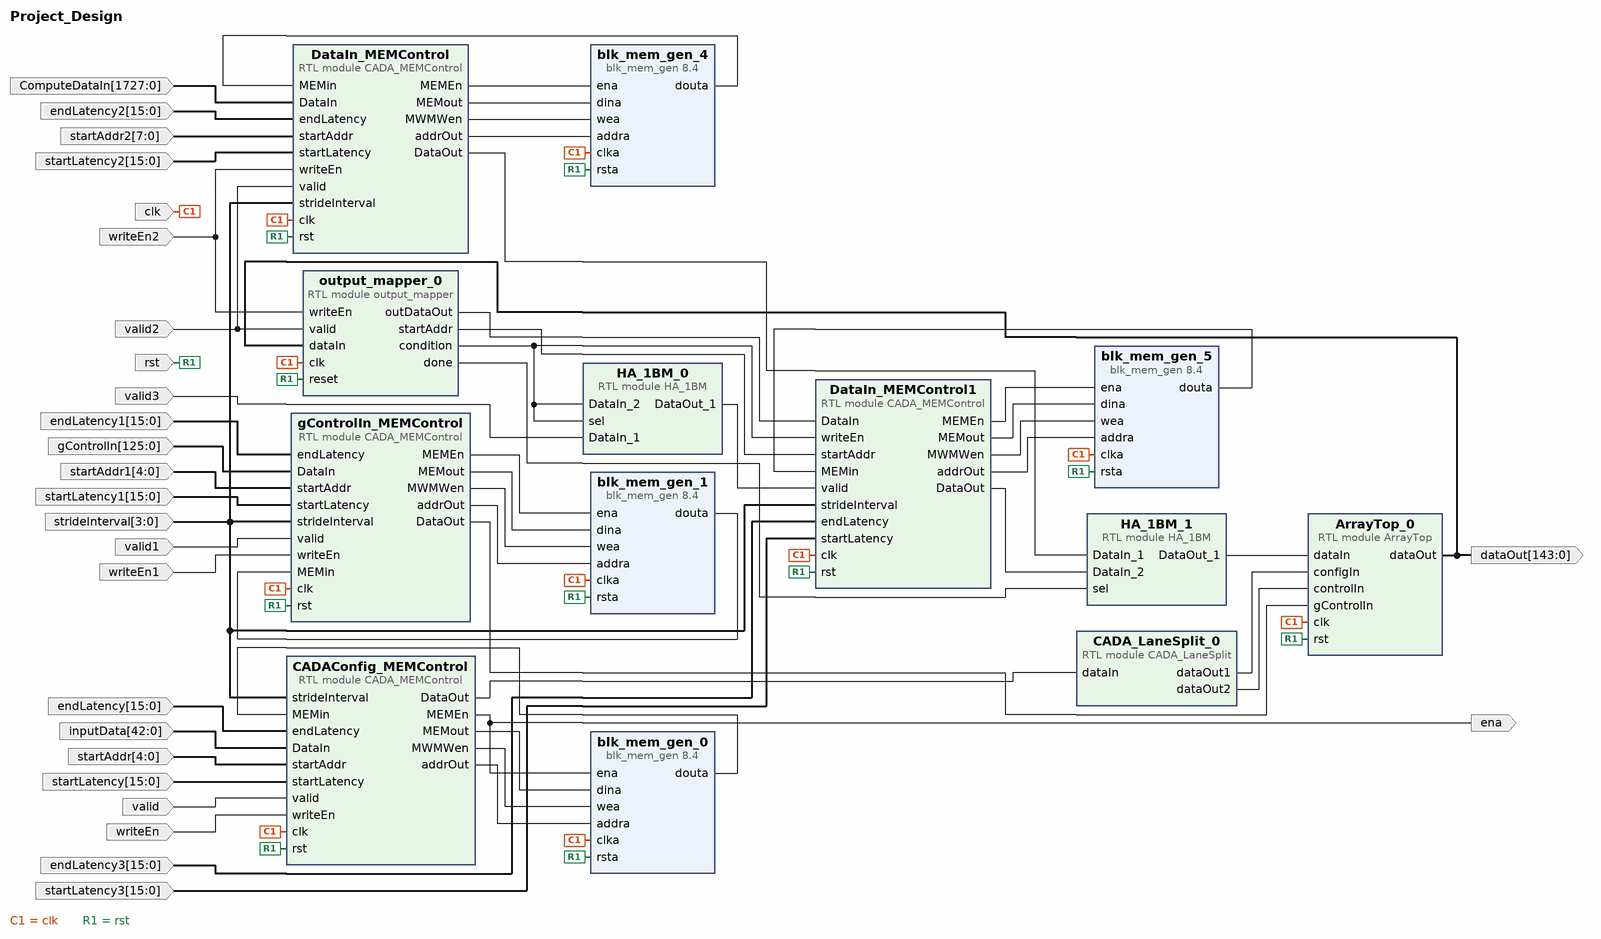
[diagram p0: block diagram of the top level]
# Vivado block design Project_Design, xc7z020clg400-2, Vivado 2023.2
create_bd_design Project_Design

create_bd_port -dir I -from 1727 -to 0 ComputeDataIn
create_bd_port -dir I clk
create_bd_port -dir O -from 143 -to 0 dataOut
create_bd_port -dir O ena
create_bd_port -dir I -from 15 -to 0 endLatency
create_bd_port -dir I -from 125 -to 0 gControlIn
create_bd_port -dir I -from 42 -to 0 inputData
create_bd_port -dir I rst
create_bd_port -dir I -from 4 -to 0 startAddr
create_bd_port -dir I -from 15 -to 0 startLatency
create_bd_port -dir I -from 3 -to 0 strideInterval
create_bd_port -dir I valid
create_bd_port -dir I writeEn
create_bd_port -dir I -from 15 -to 0 endLatency1
create_bd_port -dir I -from 4 -to 0 startAddr1
create_bd_port -dir I -from 15 -to 0 startLatency1
create_bd_port -dir I valid1
create_bd_port -dir I writeEn1
create_bd_port -dir I -from 15 -to 0 endLatency2
create_bd_port -dir I -from 15 -to 0 startLatency2
create_bd_port -dir I valid2
create_bd_port -dir I writeEn2
create_bd_port -dir I -from 7 -to 0 startAddr2
create_bd_port -dir I -from 15 -to 0 endLatency3
create_bd_port -dir I -from 15 -to 0 startLatency3
create_bd_port -dir I valid3

create_bd_cell -type module -reference ArrayTop ArrayTop_0
create_bd_cell -type module -reference CADA_LaneSplit CADA_LaneSplit_0
create_bd_cell -type module -reference CADA_MEMControl CADAConfig_MEMControl
create_bd_cell -type ip -vlnv xilinx.com:ip:blk_mem_gen:8.4 blk_mem_gen_0
set_property -dict [list \
  CONFIG.Memory_Type Single_Port_RAM \
  CONFIG.Use_RSTA_Pin true \
  CONFIG.Write_Depth_A 32 \
  CONFIG.Write_Width_A 43 \
  CONFIG.use_bram_block Stand_Alone \
] [get_bd_cells blk_mem_gen_0]
create_bd_cell -type module -reference CADA_MEMControl DataIn_MEMControl
set_property -dict {CONFIG.Data_bitWidth 1728 CONFIG.addr_BW 8} [get_bd_cells DataIn_MEMControl]
create_bd_cell -type module -reference CADA_MEMControl gControlIn_MEMControl
set_property -dict {CONFIG.Data_bitWidth 126 CONFIG.addr_BW 5} [get_bd_cells gControlIn_MEMControl]
create_bd_cell -type ip -vlnv xilinx.com:ip:blk_mem_gen:8.4 blk_mem_gen_1
set_property -dict [list \
  CONFIG.Memory_Type Single_Port_RAM \
  CONFIG.Use_RSTA_Pin true \
  CONFIG.Write_Depth_A 32 \
  CONFIG.Write_Width_A 126 \
  CONFIG.use_bram_block Stand_Alone \
] [get_bd_cells blk_mem_gen_1]
create_bd_cell -type ip -vlnv xilinx.com:ip:blk_mem_gen:8.4 blk_mem_gen_4
set_property -dict [list \
  CONFIG.Memory_Type Single_Port_RAM \
  CONFIG.Use_RSTA_Pin true \
  CONFIG.Write_Depth_A 256 \
  CONFIG.Write_Width_A 1728 \
  CONFIG.use_bram_block Stand_Alone \
] [get_bd_cells blk_mem_gen_4]
create_bd_cell -type module -reference output_mapper output_mapper_0
create_bd_cell -type module -reference CADA_MEMControl DataIn_MEMControl1
set_property -dict {CONFIG.Data_bitWidth 1728 CONFIG.addr_BW 8} [get_bd_cells DataIn_MEMControl1]
create_bd_cell -type ip -vlnv xilinx.com:ip:blk_mem_gen:8.4 blk_mem_gen_5
set_property -dict [list \
  CONFIG.Memory_Type Single_Port_RAM \
  CONFIG.Use_RSTA_Pin true \
  CONFIG.Write_Depth_A 256 \
  CONFIG.Write_Width_A 1728 \
  CONFIG.use_bram_block Stand_Alone \
] [get_bd_cells blk_mem_gen_5]
create_bd_cell -type module -reference HA_1BM HA_1BM_0
set_property -dict {CONFIG.Mux_BW 1} [get_bd_cells HA_1BM_0]
create_bd_cell -type module -reference HA_1BM HA_1BM_1
set_property -dict {CONFIG.Mux_BW 1728} [get_bd_cells HA_1BM_1]

# ---- connections ----

connect_bd_net [get_bd_pins ArrayTop_0/dataOut] [get_bd_ports dataOut] [get_bd_pins output_mapper_0/dataIn]
connect_bd_net [get_bd_pins CADA_LaneSplit_0/dataOut1] [get_bd_pins ArrayTop_0/configIn]
connect_bd_net [get_bd_pins CADA_LaneSplit_0/dataOut2] [get_bd_pins ArrayTop_0/controlIn]
connect_bd_net -net CADA_MEMControl_0_DataOut [get_bd_pins CADAConfig_MEMControl/DataOut] [get_bd_pins CADA_LaneSplit_0/dataIn]
connect_bd_net -net CADA_MEMControl_0_MEMEn [get_bd_pins CADAConfig_MEMControl/MEMEn] [get_bd_pins blk_mem_gen_0/ena] [get_bd_ports ena]
connect_bd_net -net CADA_MEMControl_0_MEMout [get_bd_pins CADAConfig_MEMControl/MEMout] [get_bd_pins blk_mem_gen_0/dina]
connect_bd_net -net CADA_MEMControl_0_MWMWen [get_bd_pins CADAConfig_MEMControl/MWMWen] [get_bd_pins blk_mem_gen_0/wea]
connect_bd_net -net CADA_MEMControl_0_addrOut [get_bd_pins CADAConfig_MEMControl/addrOut] [get_bd_pins blk_mem_gen_0/addra]
connect_bd_net -net CADA_MEMControl_2_DataOut [get_bd_pins gControlIn_MEMControl/DataOut] [get_bd_pins ArrayTop_0/gControlIn]
connect_bd_net -net CADA_MEMControl_2_MEMEn [get_bd_pins gControlIn_MEMControl/MEMEn] [get_bd_pins blk_mem_gen_1/ena]
connect_bd_net -net CADA_MEMControl_2_MEMout [get_bd_pins gControlIn_MEMControl/MEMout] [get_bd_pins blk_mem_gen_1/dina]
connect_bd_net -net CADA_MEMControl_2_MWMWen [get_bd_pins gControlIn_MEMControl/MWMWen] [get_bd_pins blk_mem_gen_1/wea]
connect_bd_net -net CADA_MEMControl_2_addrOut [get_bd_pins gControlIn_MEMControl/addrOut] [get_bd_pins blk_mem_gen_1/addra]
connect_bd_net [get_bd_ports ComputeDataIn] [get_bd_pins DataIn_MEMControl/DataIn]
connect_bd_net [get_bd_pins DataIn_MEMControl1/DataOut] [get_bd_pins HA_1BM_1/DataIn_2]
connect_bd_net [get_bd_pins DataIn_MEMControl1/MEMEn] [get_bd_pins blk_mem_gen_5/ena]
connect_bd_net [get_bd_pins DataIn_MEMControl1/MEMout] [get_bd_pins blk_mem_gen_5/dina]
connect_bd_net [get_bd_pins DataIn_MEMControl1/MWMWen] [get_bd_pins blk_mem_gen_5/wea]
connect_bd_net [get_bd_pins DataIn_MEMControl1/addrOut] [get_bd_pins blk_mem_gen_5/addra]
connect_bd_net [get_bd_pins DataIn_MEMControl/DataOut] [get_bd_pins HA_1BM_1/DataIn_1]
connect_bd_net [get_bd_pins DataIn_MEMControl/MEMEn] [get_bd_pins blk_mem_gen_4/ena]
connect_bd_net [get_bd_pins DataIn_MEMControl/MEMout] [get_bd_pins blk_mem_gen_4/dina]
connect_bd_net [get_bd_pins DataIn_MEMControl/MWMWen] [get_bd_pins blk_mem_gen_4/wea]
connect_bd_net [get_bd_pins DataIn_MEMControl/addrOut] [get_bd_pins blk_mem_gen_4/addra]
connect_bd_net [get_bd_pins HA_1BM_0/DataOut_1] [get_bd_pins DataIn_MEMControl1/valid]
connect_bd_net [get_bd_pins HA_1BM_1/DataOut_1] [get_bd_pins ArrayTop_0/dataIn]
connect_bd_net [get_bd_ports writeEn2] [get_bd_pins DataIn_MEMControl/writeEn] [get_bd_pins output_mapper_0/writeEn]
connect_bd_net [get_bd_pins blk_mem_gen_0/douta] [get_bd_pins CADAConfig_MEMControl/MEMin]
connect_bd_net [get_bd_pins blk_mem_gen_1/douta] [get_bd_pins gControlIn_MEMControl/MEMin]
connect_bd_net [get_bd_pins blk_mem_gen_4/douta] [get_bd_pins DataIn_MEMControl/MEMin]
connect_bd_net [get_bd_pins blk_mem_gen_5/douta] [get_bd_pins DataIn_MEMControl1/MEMin]
connect_bd_net [get_bd_ports clk] \
  [get_bd_pins CADAConfig_MEMControl/clk] [get_bd_pins blk_mem_gen_0/clka] [get_bd_pins blk_mem_gen_1/clka] \
  [get_bd_pins blk_mem_gen_4/clka] [get_bd_pins ArrayTop_0/clk] [get_bd_pins gControlIn_MEMControl/clk] \
  [get_bd_pins DataIn_MEMControl/clk] [get_bd_pins blk_mem_gen_5/clka] [get_bd_pins DataIn_MEMControl1/clk] \
  [get_bd_pins output_mapper_0/clk]
connect_bd_net -net endLatency1_1 [get_bd_ports endLatency1] [get_bd_pins gControlIn_MEMControl/endLatency]
connect_bd_net -net endLatency2_1 [get_bd_ports endLatency2] [get_bd_pins DataIn_MEMControl/endLatency]
connect_bd_net -net endLatency3_1 [get_bd_ports endLatency3] [get_bd_pins DataIn_MEMControl1/endLatency]
connect_bd_net [get_bd_ports endLatency] [get_bd_pins CADAConfig_MEMControl/endLatency]
connect_bd_net [get_bd_ports gControlIn] [get_bd_pins gControlIn_MEMControl/DataIn]
connect_bd_net [get_bd_ports inputData] [get_bd_pins CADAConfig_MEMControl/DataIn]
connect_bd_net [get_bd_pins output_mapper_0/condition] \
  [get_bd_pins HA_1BM_0/DataIn_2] [get_bd_pins HA_1BM_0/sel] [get_bd_pins DataIn_MEMControl1/writeEn]
connect_bd_net [get_bd_pins output_mapper_0/done] [get_bd_pins HA_1BM_1/sel]
connect_bd_net [get_bd_pins output_mapper_0/outDataOut] [get_bd_pins DataIn_MEMControl1/DataIn]
connect_bd_net [get_bd_pins output_mapper_0/startAddr] [get_bd_pins DataIn_MEMControl1/startAddr]
connect_bd_net [get_bd_ports rst] \
  [get_bd_pins CADAConfig_MEMControl/rst] [get_bd_pins blk_mem_gen_0/rsta] [get_bd_pins blk_mem_gen_1/rsta] \
  [get_bd_pins blk_mem_gen_4/rsta] [get_bd_pins ArrayTop_0/rst] [get_bd_pins gControlIn_MEMControl/rst] \
  [get_bd_pins DataIn_MEMControl/rst] [get_bd_pins DataIn_MEMControl1/rst] [get_bd_pins blk_mem_gen_5/rsta] \
  [get_bd_pins output_mapper_0/reset]
connect_bd_net -net startAddr1_1 [get_bd_ports startAddr1] [get_bd_pins gControlIn_MEMControl/startAddr]
connect_bd_net -net startAddr2_1 [get_bd_ports startAddr2] [get_bd_pins DataIn_MEMControl/startAddr]
connect_bd_net [get_bd_ports startAddr] [get_bd_pins CADAConfig_MEMControl/startAddr]
connect_bd_net -net startLatency1_1 [get_bd_ports startLatency1] [get_bd_pins gControlIn_MEMControl/startLatency]
connect_bd_net -net startLatency2_1 [get_bd_ports startLatency2] [get_bd_pins DataIn_MEMControl/startLatency]
connect_bd_net -net startLatency3_1 [get_bd_ports startLatency3] [get_bd_pins DataIn_MEMControl1/startLatency]
connect_bd_net [get_bd_ports startLatency] [get_bd_pins CADAConfig_MEMControl/startLatency]
connect_bd_net [get_bd_ports strideInterval] \
  [get_bd_pins CADAConfig_MEMControl/strideInterval] [get_bd_pins DataIn_MEMControl/strideInterval] \
  [get_bd_pins gControlIn_MEMControl/strideInterval] [get_bd_pins DataIn_MEMControl1/strideInterval]
connect_bd_net -net valid1_1 [get_bd_ports valid1] [get_bd_pins gControlIn_MEMControl/valid]
connect_bd_net -net valid2_1 [get_bd_ports valid2] [get_bd_pins DataIn_MEMControl/valid] [get_bd_pins output_mapper_0/valid]
connect_bd_net -net valid3_1 [get_bd_ports valid3] [get_bd_pins HA_1BM_0/DataIn_1]
connect_bd_net [get_bd_ports valid] [get_bd_pins CADAConfig_MEMControl/valid]
connect_bd_net -net writeEn1_1 [get_bd_ports writeEn1] [get_bd_pins gControlIn_MEMControl/writeEn]
connect_bd_net [get_bd_ports writeEn] [get_bd_pins CADAConfig_MEMControl/writeEn]

validate_bd_design
save_bd_design
